# EasyEDA Pro project ProProject_drv8303_f405rgt6_3_5_2025-03-30.epro, board PCB1
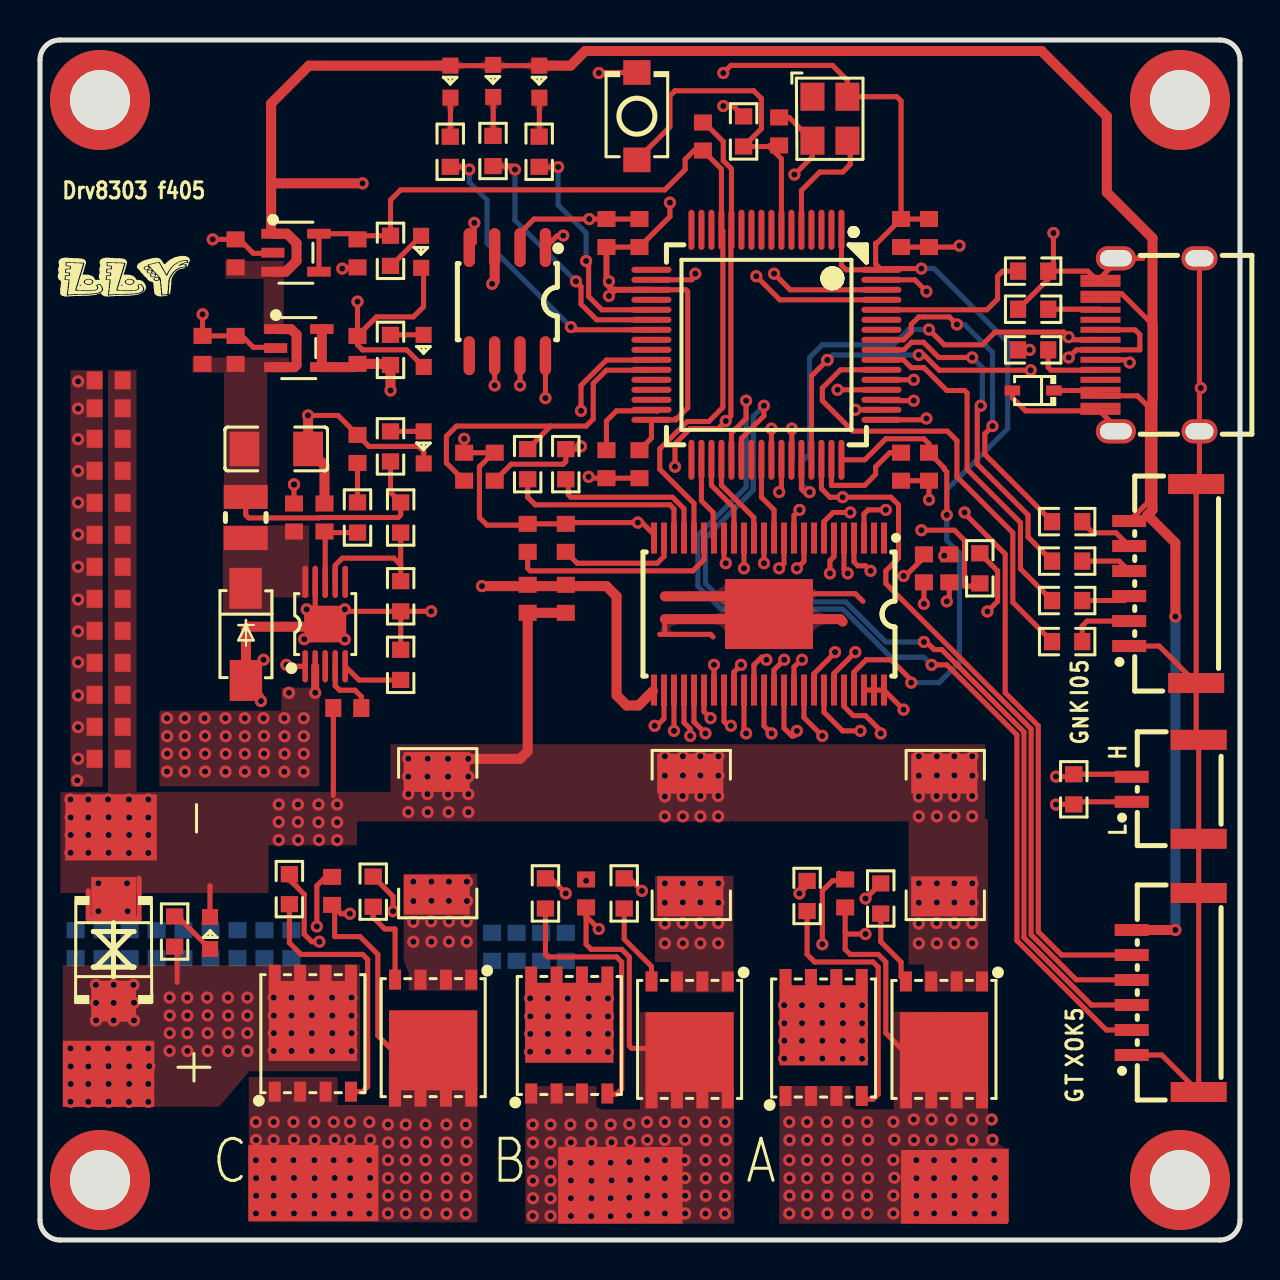
[diagram p1: board, top side]
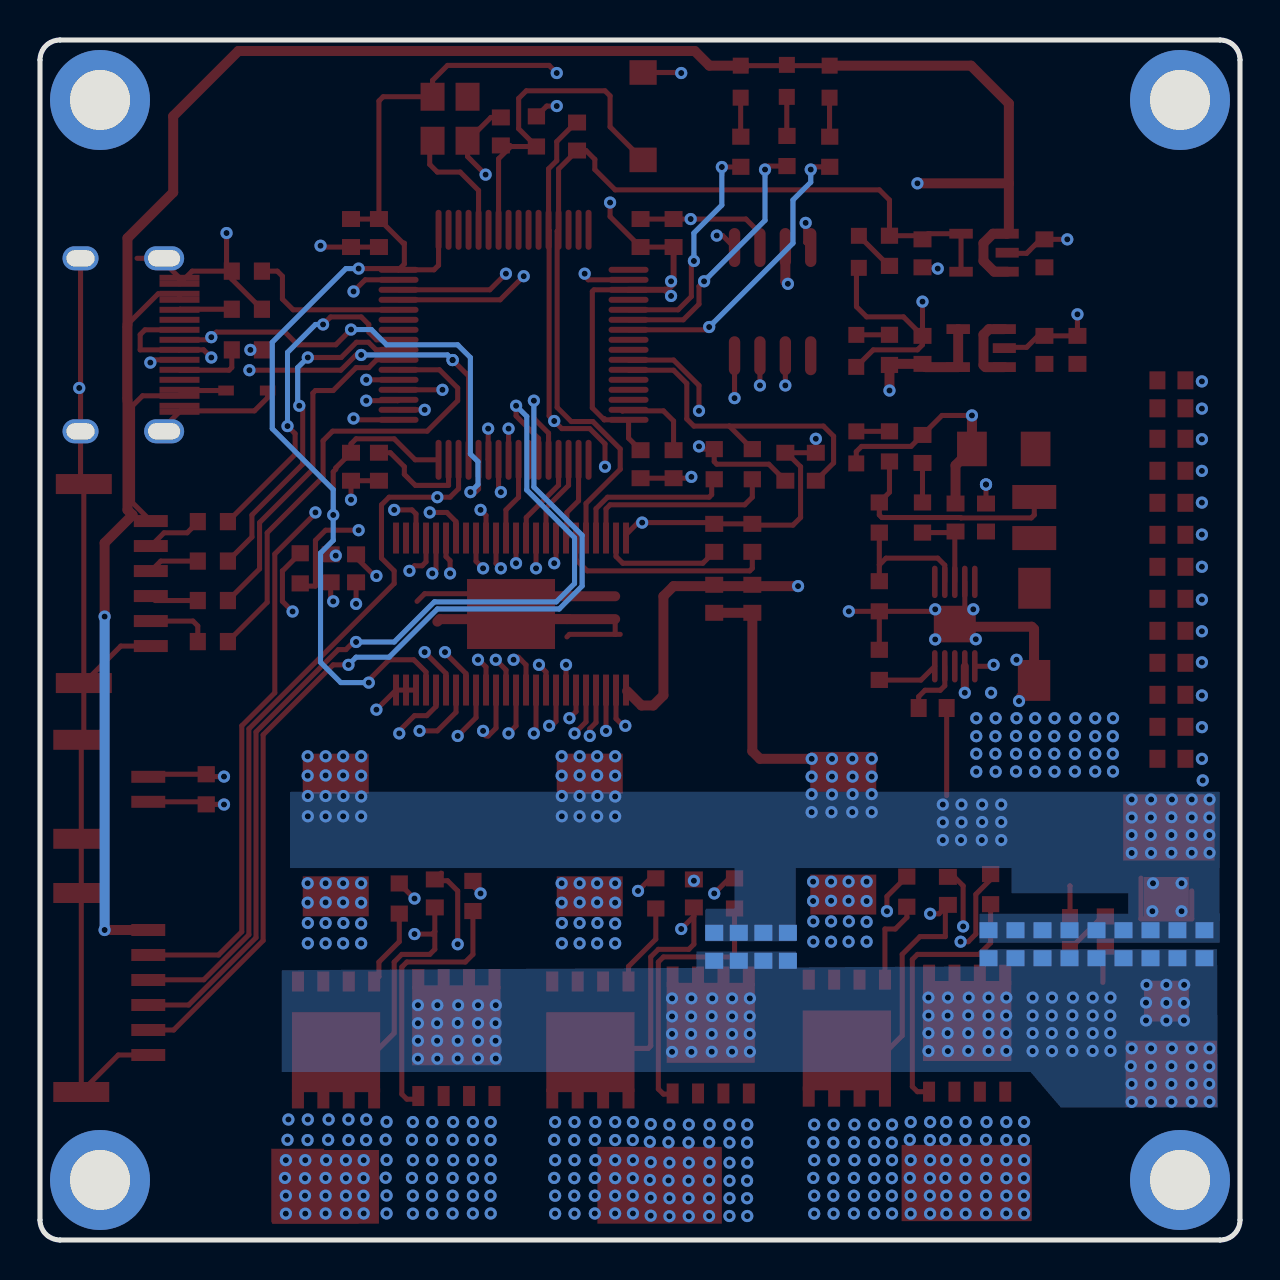
[diagram p2: board, bottom side, seen from below]

Outline 60 x 60 mm; copper layers: Top Layer, Inner1, Inner2, Bottom Layer. Coordinates in mm from the lower left corner of the outline.
Outline path: 0,59 0,1 arc(0.29,0.29) 1,0 59,0 arc(59.71,0.29) 60,1 60,59 arc(59.71,59.71) 59,60 1,60 arc(0.29,59.71) 0,59
Stack: Top Layer 0.035mm 外层铜厚1oz / Dielectric1 0.2104mm 7628 RC49% 8.6mil / Inner1 0.0152mm 内层铜厚 / Dielectric2 1.065mm 1.1mm H/HOZ 含铜 / Inner2 0.0152mm 内层铜厚 / Dielectric3 0.2104mm 7628 RC49% 8.6mil / Bottom Layer 0.035mm 外层铜厚1oz

## Design rules (mm)
template: JLCPCB Capability(Two Layers Board)
spacing copperThickness1oz (default): track to track 0.102, other pairs 0.152 to 0.3
spacing copperThickness2oz: track to track 0.203, other pairs 0.152 to 0.3
track width copperThickness1oz (default): min 0.127, default 0.254, max 2.54
track width copperThickness2oz: min 0.203, default 0.254, max 2.54
differential pair differentialPair (default): width min 0.127, default 0.254, max 2.54; gap min 0.152, default 0.152
via viaSize (default): diameter min 0.5, default 0.61, max 10; hole min 0.3, default 0.305, max 6.3

## Placement (name value [footprint] x y rotation side)
C1  2.2uf  [C0603]  28.32 38.79 90 top
C2  2.2uf  [C0603]  43.05 38.66 90 top
C3  0.1uf  [C0603]  36.96 55.43 270 top
C4  22nF  [C0603]  44.2 33.58 90 top
C7  0.1uf  [C0603]  26.29 32.06 90 top
C8  2.2uf  [C0603]  24.38 32.06 90 top
C9  1uf  [C0603]  26.29 35.11 90 top
C10  2.2uf  [C0603]  45.47 33.58 90 top
C11  1uf  [C0603]  24.38 35.11 90 top
C12  100nF  [C0603]  40.26 17.33 270 top
C13  100nF  [C0603]  27.31 17.33 270 top
C14  100nF  [C0603]  14.6 17.45 270 top
C15  2.2nf  [C0603]  22.73 38.66 270 top
C16  2.2nf  [C0603]  21.21 38.66 270 top
C17  100nF  [C0603]  12.7 36.12 90 top
C18  2.2uf  [C0603]  3.43 42.98 0 top
C19  6.8nF  [C0603]  15.37 26.6 0 top
C20  6.8pf  [C0603]  14.22 36.12 90 top
C21  4.7nf  [C0603]  15.88 39.55 90 top
C27  0.1uF  [C0603]  9.78 44.51 270 top
C28  0.1uF  [C0603]  15.88 44.51 270 top
C32  0.1uF  [C0603]  9.78 49.33 270 top
C33  0.1uF  [C0603]  15.88 49.33 90 top
C85  100nF  [C0603]  44.45 38.66 90 top
C86  100nF  [C0603]  29.97 38.79 90 top
C87  100nF  [C0603]  43.05 50.35 90 top
C88  100nF  [C0603]  44.45 50.35 90 top
C89  100nF  [C0603]  28.32 50.35 270 top
C90  100nF  [C0603]  29.97 50.35 270 top
C91  100nF  [C0603]  33.15 55.17 270 top
C97  47uf  [C0603]  3.43 41.58 180 top
C98  47uf  [C0603]  3.43 40.06 180 top
C99  47uf  [C0603]  3.43 38.46 180 top
C100  47uf  [C0603]  3.43 36.86 180 top
C101  47uf  [C0603]  3.43 35.26 180 top
C102  47uf  [C0603]  3.43 33.66 180 top
C103  47uf  [C0603]  3.43 32.06 180 top
C104  47uf  [C0603]  3.43 30.46 180 top
C105  47uf  [C0603]  3.43 28.86 180 top
C106  47uf  [C0603]  3.43 27.26 180 top
C107  47uf  [C0603]  3.43 25.66 180 top
C108  47uf  [C0603]  3.43 24.06 180 top
C109  47uF  [C1206]  11.81 39.55 0 top
C110  0.1uF  [C0603]  8.13 44.51 90 top
C111  47uf  [C0603]  12.57 14.79 270 bottom
C112  47uf  [C0603]  7.18 14.79 270 bottom
C113  47uf  [C0603]  11.22 14.79 270 bottom
C114  47uf  [C0603]  9.87 14.79 270 bottom
C115  47uf  [C0603]  8.53 14.79 270 bottom
C116  47uf  [C0603]  5.83 14.79 270 bottom
C117  47uf  [C0603]  4.48 14.79 270 bottom
C118  47uf  [C0603]  3.13 14.79 270 bottom
C120  47uf  [C0603]  26.29 14.66 270 bottom
C121  47uf  [C0603]  25.06 14.66 270 bottom
C122  47uf  [C0603]  23.83 14.66 270 bottom
C123  47uf  [C0603]  22.61 14.66 270 bottom
C124  47uf  [C0603]  1.78 14.79 270 bottom
CN2  WAFER-GH1.25-2PLB  [CONN-TH_2P-P1.25_XUNPU_WAFER-GH1.25-2PLB]  56.26 22.53 90 top
D4  B16WS  [SOD-323_L1.7-W1.3-LS2.5-FD]  49.66 42.47 0 top
D5  SS34  [SMA_L4.3-W2.6-LS5.0-FD]  10.29 30.28 90 top
D6  SMBJ36CA  [SMB_L4.6-W3.6-LS5.4-BI]  3.68 14.53 270 top
L3  22uH  [IND-SMD_L2.5-W2.0]  10.29 36.12 270 top
LED4  -  [LED_0603]  24.96 57.97 90 top
LED5  -  [LED_0603]  22.65 58.01 90 top
LED6  -  [LED_0603]  19.18 39.68 90 top
LED7  -  [LED_0603]  19.18 44.51 90 top
LED9  -  [LED_0603]  19.05 49.46 90 top
LED10  -  [LED_0603]  20.51 57.97 90 top
LED11  -  [LED_0603]  8.51 15.3 270 top
N  WAFER-GH1.25-6PLB  [CONN-SMD_6P-P1.25_XUNPU_WAFER-GH1.25-6PLB]  56.13 32.82 90 top
NOREF  -  [Pad_e122]  3 3 0 top
NOREF#2  -  [Pad_e16011]  46.23 2.66 0 top
NOREF#3  -  [Pad_e86]  3.56 20.63 0 top
NOREF#4  -  [Pad_e16010]  29.02 2.74 0 top
NOREF#5  -  [Pad_e124]  57 3 0 top
NOREF#6  -  [Pad_e16012]  45.72 2.66 0 top
NOREF#7  -  [Pad_e126]  57 57 0 top
NOREF#8  -  [Pad_e16009]  13.67 2.85 0 top
NOREF#9  -  [Pad_e287]  11.84 2.81 0 top
NOREF#10  -  [Pad_e125]  3 57 0 top
NOREF#11  -  [Pad_e93]  47.12 2.72 180 top
NOREF#12  -  [Pad_e85]  3.43 8.31 0 top
NOREF#13  -  [Pad_e94]  29.46 2.72 0 top
Q1  HYG025N06LS1C2  [DFN-8_L5.9-W5.2-P1.27-LS6.2-BL]  39.18 10.12 0 top
Q5  HYG025N06LS1C2  [DFN-8_L5.9-W5.2-P1.27-LS6.2-BL]  26.46 10.25 0 top
Q6  HYG025N06LS1C2  [DFN-8_L5.9-W5.2-P1.27-LS6.2-BL]  13.64 10.34 0 top
Q7  HYG025N06LS1C2  [DFN-8_L5.9-W5.2-P1.27-LS6.2-BL]  45.2 10 180 top
Q8  HYG025N06LS1C2  [DFN-8_L5.9-W5.2-P1.27-LS6.2-BL]  32.48 10 180 top
Q9  HYG025N06LS1C2  [DFN-8_L5.9-W5.2-P1.27-LS6.2-BL]  19.66 10.09 180 top
R1  4.7k  [R0603]  49.66 48.44 0 top
R2  10K  [R0603]  35.18 55.43 270 top
R3  18K  [R0603]  46.99 33.58 270 top
R4  22R  [R0603]  26.29 38.79 270 top
R5  22R  [R0603]  24.38 38.79 270 top
R16  5.1K  [R0603]  49.66 44.51 0 top
R17  5.1K  [R0603]  49.66 46.54 180 top
R23  120R  [R0603]  51.69 22.53 90 top
R26  1K  [R0603]  24.96 54.41 90 top
R27  1K  [R0603]  22.65 54.45 90 top
R28  1K  [R0603]  17.53 39.68 270 top
R29  1K  [R0603]  17.53 44.51 270 top
R31  1K  [R0603]  17.53 49.46 90 top
R36  1K  [R0603]  20.51 54.41 90 top
R55  86.6k  [R0603]  15.88 36.12 90 top
R56  52.3k  [R0603]  18.03 36.12 270 top
R57  10k  [R0603]  18.03 32.19 270 top
R64  365K  [R0603]  18.03 28.76 270 top
R65  2.2R  [R0603]  38.35 17.2 90 top
R66  2.2R  [R0603]  25.27 17.33 90 top
R67  2.2R  [R0603]  12.47 17.54 90 top
R68  2.2R  [R0603]  16.66 17.42 90 top
R69  2.2R  [R0603]  29.21 17.33 90 top
R70  2.2R  [R0603]  42.04 17.07 90 top
R71  22R  [R0603]  51.36 35.92 180 top
R72  22R  [R0603]  51.36 33.95 180 top
R73  22R  [R0603]  51.36 31.97 180 top
R74  22R  [R0603]  51.36 29.92 180 top
R75  10K  [R0603]  6.73 15.42 270 top
SW9  TS-1088-AR02016  [SW-SMD_L3.9-W3.0-P4.45]  29.84 56.19 90 top
U1  STM32F405RGT6TR  [LQFP-64_L10.0-W10.0-P0.50-LS12.0-BL]  36.32 44.76 180 top
U2  DRV8303DCA  [HTSSOP-48_L12.5-W6.1-P0.50-LS8.1-BL-EP4.4]  36.45 31.3 180 top
U3  TPS54160ADGQR  [MSOP-10_L3.0-W3.0-P0.50-LS5.0-BL-EP]  14.26 30.8 0 top
U6  RT9013-33GB  [SOT-23-5_L3.0-W1.7-P0.95-LS2.8-BL]  12.94 44.59 270 top
U7  RT9013-33GB  [SOT-23-5_L3.0-W1.7-P0.95-LS2.8-BL]  12.79 49.36 270 top
U8  0.5mΩ  [RES-SMD_L6.4-W3.2-R2512]  32.51 20.25 270 top
U9  0.5mΩ  [RES-SMD_L6.4-W3.2-R2512]  19.84 20.34 270 top
U12  WAFER-GH1.25-6PLB  [CONN-SMD_6P-P1.25_XUNPU_WAFER-GH1.25-6PLB]  56.26 12.38 90 top
U14  0.5mΩ  [RES-SMD_L6.4-W3.2-R2512]  45.21 20.25 270 top
U15  TJA1050T/CM,118  [SOIC-8_L5.0-W4.0-P1.27-LS6.0-BL]  23.37 46.92 180 top
USBC1  TYPE-C-31-M-12  [USB-C_SMD-TYPE-C-31-M-12]  55.5 44.76 90 top
X2  8MHz  [OSC-SMD_4P-L3.2-W2.5-BL]  39.5 56.06 270 top

## Footprints (pads in the part's own frame, mm; a bottom-side part is the same pattern mirrored in y, then rotated)
C0603
  rect 0.8x0.9 smd: 1(-0.7,0) 2(0.7,0)
C1206
  rect 1.485x1.728 smd: 1(-1.593,0) 2(1.593,0)
CONN-SMD_6P-P1.25_XUNPU_WAFER-GH1.25-6PLB
  rect 0.6x1.7 smd: 1(-3.125,1.675) 2(-1.875,1.675) 3(-0.625,1.675) 4(0.625,1.675) 5(1.875,1.675) 6(3.125,1.675)
  rect 1x2.8 smd: 7(4.975,-1.675) 8(-4.975,-1.675)
CONN-TH_2P-P1.25_XUNPU_WAFER-GH1.25-2PLB
  rect 0.6x1.7 smd: 1(-0.625,1.675) 2(0.625,1.675)
  rect 1x2.8 smd: 3(2.475,-1.675) 4(-2.475,-1.675)
DFN-8_L5.9-W5.2-P1.27-LS6.2-BL
  rect 0.6x1 smd: 1(-1.905,-2.925) 2(-0.635,-2.925) 3(0.635,-2.925) 4(1.905,-2.925) 5(1.905,2.925) 6(0.635,2.925) 7(-0.635,2.925) 8(-1.905,2.925)
  rect 4.41x4 smd: 9(0,0.61)
HTSSOP-48_L12.5-W6.1-P0.50-LS8.1-BL-EP4.4
  rect 0.3x1.55 smd: 1(-5.75,-3.8) 2(-5.25,-3.8) 3(-4.75,-3.8) 4(-4.25,-3.8) 5(-3.75,-3.8) 6(-3.25,-3.8) 7(-2.75,-3.8) 8(-2.25,-3.8) 9(-1.75,-3.8) 10(-1.25,-3.8) 11(-0.75,-3.8) 12(-0.25,-3.8) 13(0.25,-3.8) 14(0.75,-3.8) 15(1.25,-3.8) 16(1.75,-3.8) 17(2.25,-3.8) 18(2.75,-3.8) 19(3.25,-3.8) 20(3.75,-3.8) 21(4.25,-3.8) 22(4.75,-3.8) 23(5.25,-3.8) 24(5.75,-3.8) 25(5.75,3.8) 26(5.25,3.8) 27(4.75,3.8) 28(4.25,3.8) 29(3.75,3.8) 30(3.25,3.8) 31(2.75,3.8) 32(2.25,3.8) 33(1.75,3.8) 34(1.25,3.8) 35(0.75,3.8) 36(0.25,3.8) 37(-0.25,3.8) 38(-0.75,3.8) 39(-1.25,3.8) 40(-1.75,3.8) 41(-2.25,3.8) 42(-2.75,3.8) 43(-3.25,3.8) 44(-3.75,3.8) 45(-4.25,3.8) 46(-4.75,3.8) 47(-5.25,3.8) 48(-5.75,3.8)
  rect 4.4x3.5 smd: 49(0,0)
IND-SMD_L2.5-W2.0
  rect 1.2x2.2 smd: 1(1.028,0) 2(-1.028,0)
LED_0603
  rect 0.8x0.8 smd: 1(-0.851,-0.01) 2(0.75,-0.005)
LQFP-64_L10.0-W10.0-P0.50-LS12.0-BL
  oval 0.3x2 smd: 1(-3.75,-5.75) 2(-3.25,-5.75) 3(-2.75,-5.75) 4(-2.25,-5.75) 5(-1.75,-5.75) 6(-1.25,-5.75) 7(-0.75,-5.75) 8(-0.25,-5.75) 9(0.25,-5.75) 10(0.75,-5.75) 11(1.25,-5.75) 12(1.75,-5.75) 13(2.25,-5.75) 14(2.75,-5.75) 15(3.25,-5.75) 16(3.75,-5.75) 33(3.75,5.75) 34(3.25,5.75) 35(2.75,5.75) 36(2.25,5.75) 37(1.75,5.75) 38(1.25,5.75) 39(0.75,5.75) 40(0.25,5.75) 41(-0.25,5.75) 42(-0.75,5.75) 43(-1.25,5.75) 44(-1.75,5.75) 45(-2.25,5.75) 46(-2.75,5.75) 47(-3.25,5.75) 48(-3.75,5.75)
  oval 2x0.3 smd: 17(5.75,-3.75) 18(5.75,-3.25) 19(5.75,-2.75) 20(5.75,-2.25) 21(5.75,-1.75) 22(5.75,-1.25) 23(5.75,-0.75) 24(5.75,-0.25) 25(5.75,0.25) 26(5.75,0.75) 27(5.75,1.25) 28(5.75,1.75) 29(5.75,2.25) 30(5.75,2.75) 31(5.75,3.25) 32(5.75,3.75) 49(-5.75,3.75) 50(-5.75,3.25) 51(-5.75,2.75) 52(-5.75,2.25) 53(-5.75,1.75) 54(-5.75,1.25) 55(-5.75,0.75) 56(-5.75,0.25) 57(-5.75,-0.25) 58(-5.75,-0.75) 59(-5.75,-1.25) 60(-5.75,-1.75) 61(-5.75,-2.25) 62(-5.75,-2.75) 63(-5.75,-3.25) 64(-5.75,-3.75)
MSOP-10_L3.0-W3.0-P0.50-LS5.0-BL-EP
  oval 0.28x1.62 smd: 1(-1,-2.11) 2(-0.5,-2.11) 3(0,-2.11) 4(0.5,-2.11) 5(1,-2.11) 6(1,2.11) 7(0.5,2.11) 8(0,2.11) 9(-0.5,2.11) 10(-1,2.11)
  rect 2.1x1.83 smd: 11(0,0)
OSC-SMD_4P-L3.2-W2.5-BL
  rect 1.4x1.2 smd: 1(-1.1,-0.875) 2(1.1,-0.875) 3(1.1,0.875) 4(-1.1,0.875)
Pad_e85
  custom 4.572x3.306 smd: 65(0,0)
Pad_e86
  custom 4.572x3.306 smd: 65(0,0)
Pad_e93
  custom 2.667x3.683 smd: 66(0,0)
Pad_e94
  custom 2.667x3.683 smd: 66(0,0)
Pad_e122
  round 5 hole 3: 1(0,0)
Pad_e124
  round 5 hole 3: 1(0,0)
Pad_e125
  round 5 hole 3: 1(0,0)
Pad_e126
  round 5 hole 3: 1(0,0)
Pad_e287
  custom 2.667x3.683 smd: 66(0,0)
Pad_e16009
  custom 6.508x3.81 smd: 1(0,0)
Pad_e16010
  custom 6.223x3.838 smd: 2(0,0)
Pad_e16011
  custom 4.318x3.683 smd: 3(0,0)
Pad_e16012
  custom 5.34x3.683 smd: 4(0,0)
R0603
  rect 0.806x0.864 smd: 1(-0.753,0) 2(0.753,0)
RES-SMD_L6.4-W3.2-R2512
  rect 2x3.3 smd: 1(-3.067,0) 2(3.067,0)
SMA_L4.3-W2.6-LS5.0-FD
  rect 2.046x1.62 smd: 1(-2.304,-0.009) 2(2.304,0.009)
SMB_L4.6-W3.6-LS5.4-BI
  rect 2.047x2.241 smd: 1(-2.591,0) 2(2.591,0)
SOD-323_L1.7-W1.3-LS2.5-FD
  rect 0.78x0.5 smd: 1(-1.04,0) 2(1.04,0)
SOIC-8_L5.0-W4.0-P1.27-LS6.0-BL
  oval 0.569x1.95 smd: 1(-1.905,-2.705) 2(-0.635,-2.705) 3(0.635,-2.705) 4(1.905,-2.705) 5(1.905,2.705) 6(0.635,2.705) 7(-0.635,2.705) 8(-1.905,2.705)
SOT-23-5_L3.0-W1.7-P0.95-LS2.8-BL
  rect 0.49x1.157 smd: 1(-0.95,-1.153) 2(0,-1.153) 3(0.95,-1.153)
  rect 0.49x1.175 smd: 4(0.95,1.153) 5(-0.95,1.153)
SW-SMD_L3.9-W3.0-P4.45
  rect 1.23x1.36 smd: 1(-2.185,0) 2(2.185,0)
USB-C_SMD-TYPE-C-31-M-12
  oval 1.2x2 hole 0.8x1.6: 0(-4.325,1.706) 1(4.325,1.706)
  oval 1.2x1.8 hole 0.8x1.4: 2(4.325,-2.474) 3(-4.325,-2.474)
  rect 0.3x2 smd: A1(-3.35,2.474) A4(-2.55,2.474) A5(-1.25,2.474) A6(-0.25,2.474) A7(0.25,2.474) A8(1.25,2.474) A9(2.55,2.474) A12(3.35,2.474) B1(3.05,2.474) B4(2.25,2.474) B5(1.75,2.474) B6(0.75,2.474) B7(-0.75,2.474) B8(-1.75,2.474) B9(-2.25,2.474) B12(-3.05,2.474)

## Nets
As in the schematic, except:
5V: C27.2 C32.2 C109.1 C110.1 D4.2 L3.2 LED4.2 LED5.2 LED10.2 N.6 R28.2 R56.1 U6.1 U6.3 U7.1 U7.3 U12.6 U15.3 USBC1.A4 USBC1.A9 USBC1.B4 USBC1.B9
GND: C1.1 C2.1 C3.1 C10.2 C20.2 C21.2 C27.1 C28.1 C85.1 C86.1 C87.1 C88.1 C89.1 C90.1 C109.2 C110.2 CN2.3 CN2.4 D4.1 D5.1 LED6.1 LED7.1 LED9.1 N.1 N.7 N.8 R1.2 R3.1 R16.1 R17.2 R57.2 R64.1 SW9.2 U1.18 U1.63 U2.46 U2.47 U2.48 U2.49 U3.9 U3.11 U6.2 U12.1 U12.7 U12.8 U15.2 U15.8 USBC1.0 USBC1.1 USBC1.2 USBC1.3 USBC1.A1 USBC1.A12 USBC1.B1 USBC1.B12 X2.2
PGND: C7.1 C8.1 C18.2 C19.1 C97.1 C98.1 C99.1 C100.1 C101.1 C102.1 C103.1 C104.1 C105.1 C106.1 C107.1 C108.1 C111.1 C112.1 C113.1 C114.1 C115.1 C116.1 C117.1 C118.1 C120.1 C121.1 C122.1 C123.1 C124.1 D6.1 LED11.1 NOREF#3.65 Q7.1 Q7.2 Q7.3 U2.26 U2.28 U2.40 U8.1 U9.1 U14.1 U14.2
DCBUS: C7.2 C8.2 C18.1 C97.2 C98.2 C99.2 C100.2 C101.2 C102.2 C103.2 C104.2 C105.2 C106.2 C107.2 C108.2 C111.2 C112.2 C113.2 C114.2 C115.2 C116.2 C117.2 C118.2 C120.2 C121.2 C122.2 C123.2 C124.2 D6.2 NOREF#12.65 Q1.5 Q1.6 Q1.7 Q1.8 Q1.9 Q5.5 Q5.6 Q5.7 Q5.8 Q5.9 Q6.5 Q6.6 Q6.7 Q6.8 Q6.9 R75.2 U2.25 U3.2
SH_A: C12.2 NOREF#2.3 NOREF#6.4 NOREF#11.66 Q1.1 Q1.2 Q1.3 Q7.5 Q7.6 Q7.7 Q7.8 Q7.9 U2.42
SH_B: C13.2 NOREF#4.2 NOREF#13.66 Q5.1 Q5.2 Q5.3 Q8.5 Q8.6 Q8.7 Q8.8 Q8.9 U2.37
SH_C: C14.2 NOREF#8.1 NOREF#9.66 Q6.1 Q6.2 Q6.3 Q9.5 Q9.6 Q9.7 Q9.8 Q9.9 U2.32
$1N19444: N.5 R71.1
$1N19497: N.4 R72.1
$1N19526: N.3 R73.1
$1N19555: N.2 R74.1

Pads without a net: NOREF 1; NOREF#5 1; NOREF#7 1; NOREF#10 1; U1 2 3 4 6 8 9 10 11 14 15 16 17 20 24 25 28 29 30 33 39 58 59; U2 1 2 8; U3 3 6; U15 5; USBC1 A8 B8; X2 1

## Via types
v1: diameter 0.61, hole 0.305, Top Layer to Bottom Layer, 630 vias

## Routing (per net, layer and track width the routed paths; a pad name or vN(x,y) marks a point on that pad's centre or on a via; arc(x,y) is an arc through that point)
5V: length 152.5
  Top Layer w0.254: 20.2,58.72 24.77,58.72 ; L3.2 10.29,36.25 10.44,36.1 13.95,36.1 13.97,36.12 17.91,36.12 18.03,36.25 R56.1 17.53,37.39 R28.2 ; USBC1.B9 52.99,42.47 D4.2 ; 55.37,41.71 54.87,42.21 USBC1.A4 ; 55.37,41.71 55.75,42.09 55.75,45.65 54.09,47.31 USBC1.A9 USBC1.B4 ; 55.37,41.71 55.37,36.86 54.46,35.95
  Top Layer w0.5: 11.56,52.83 11.56,56.83 13.45,58.72 20.2,58.72 ; 11.56,52.83 v1(16.13,52.83) ; 11.56,52.83 11.56,50.4 U7.1 12.35,50.31 12.83,49.84 12.83,48.95 12.29,48.41 U7.3 ; U15.3 22.73,47.94 v1(22.61,47.81) ; U6.1 12.55,45.55 12.83,45.27 12.83,43.74 12.73,43.64 U6.3 ; 24.77,58.72 26.53,58.72 27.26,59.45 50.08,59.45 53.34,56.19 53.34,52.38 55.63,50.09 55.63,36.5 55.37,36.25 56.77,34.85 v1(56.77,31.17) ; U12.6 v1(56.77,15.5)
  Inner1 w0.5: v1(16.13,52.83) 18.72,52.83 20.7,50.86 20.7,48.06 20.96,47.81 v1(22.61,47.81) 25.27,47.81
  Bottom Layer w0.5: v1(56.77,31.17) 56.77,15.55
AGND: length 65.3
  Top Layer w0.254: 22.67,39.36 21.97,38.66 21.97,36.12 22.35,35.74 24.32,35.74 C11.2 C9.2 26.35,35.87 30.1,35.87 30.7,35.27 U2.24 ; 22.67,39.36 C15.1 ; 22.67,39.36 C16.1 v1(21.21,40.06) ; U7.2 11.61,49.33 10.67,49.33 9.97,50.03 C32.1 v1(8.64,50.03) ; v1(31.75,38.66) 31.75,39.81 32.51,40.57 33.91,40.57 v1(34.29,40.95) 34.54,41.2 34.54,50.48 U1.12 34.57,53.56 34.16,53.97 34.16,54.92 33.31,55.77 33.15,55.77 ; C33.1 15.18,48.63 v1(15.11,48.57)
  Inner1 w0.254: v1(21.21,40.06) 21.21,41.33 21.08,41.46 16,41.46 15.11,42.35 v1(15.11,48.57) 15.11,49.2 14.86,49.46 11.81,49.46 11.68,49.33 10.67,49.33 10.67,49.46 10.03,50.09 9.97,50.03 v1(8.64,50.03) ; v1(31.75,38.66) 29.97,38.66 29.84,38.54 29.84,35.87
  vias: v1(29.89,35.87)
AVCC: length 46.8
  Top Layer w0.254: U2.20 32.7,36.83 30.99,38.54 30.99,39.55 32.36,40.92 33.44,40.92 34.14,41.63 34.14,50.44 U1.13 34.07,53.55 C91.2 32.7,54.47 32.26,54.03 32.26,53.52 31.24,52.51 18.03,52.51 17.53,52 R31.2 16.06,50.21 C33.2 15.59,50.31 U7.5 U7.4
GND: length 174.6
  Top Layer w0.254: 43.18,26.47 v1(43.18,26.52) U2.48 U2.47 U2.46 ; v1(44.32,47.43) 43.74,48.01 U1.63 ; 54.46,29.7 55.96,29.7 N.8 ; v1(45.97,49.71) 45.91,49.65 C88.1 C87.1 ; 19.19,38.83 19.19,39.42 18.92,39.68 16.45,39.68 C21.2 14.9,41.23 v1(13.4,41.23) ; U3.9 13.76,31.3 U3.11 14.9,31.43 R57.2 ; USBC1.0 53.79,40.64 USBC1.A1 52.98,41.46 49.28,41.46 48.62,42.12 48.62,42.47 ; N.8 N.7 57.97,37.96 USBC1.3 57.97,42.53 v1(58.04,42.6) 57.97,42.67 57.97,49.08 ; N.8 57.81,25.14 CN2.3 CN2.4 U12.7 U12.8 56.09,9.25 U12.1 ; C86.1 C1.1 27.56,38.09 ; v1(11.05,26.95) 11.05,27.23 D5.1 10.3,28.26 10.42,28.26 v1(11.18,29.01) ; U6.2 11.75,44.63 10.67,44.63 10.09,45.21 C27.1 C110.2 v1(8.13,46.28) ; U15.2 24,50.35 24.7,51.05 v1(27.47,51.05) C89.1 C90.1 ; C2.1 C85.1 v1(44.45,37.01) ; C28.1 v1(15.88,46.92) ; C28.1 15.88,44.76 16.13,44.51 18.34,44.51 19.19,43.66 ; C28.1 16.83,46.16 18.67,46.16 19.18,46.67 19.18,48.49 LED9.1 ; v1(47.37,31.42) 47.88,31.93 47.88,33.46 47.87,33.46 R3.1 ; R1.2 50.41,48.04 R17.2 ; R1.2 52.39,48.44 USBC1.B1 USBC1.A12 53.79,48.88 53.79,49.08 55.15,49.08 ; R1.2 50.67,48.71 v1(50.67,50.35) ; R57.2 R64.1 ; R57.2 v1(19.56,31.43) ; C3.1 37.46,56.13 X2.2 38.62,54.17 v1(37.72,53.27) ; SW9.2 27.97,58.38 v1(27.94,58.35) ; 41.15,31.93 40.77,32.31 37.47,32.31 U2.49 36.32,31.17 33.53,31.17 33.66,31.04 ; 31.24,30.28 33.53,30.28 33.66,30.16 ; 31.24,30.28 30.99,30.28 ; 31.24,30.28 31.24,31.04 ; U1.18 32.59,48.01 32.77,48.19 ; U15.8 v1(25.27,42.09)
  Top Layer w0.5: 31.24,32.19 35.25,32.19 36.4,31.04 ; C20.2 14.22,38.73 C109.2 v1(13.4,41.23) ; 36.4,31.04 40,31.04 40.13,30.92 ; 36.4,31.04 31.24,31.04 ; U3.11 14.13,30.66 10.41,30.66 10.3,30.55 10.3,28.26
  vias: v1(13.21,30.04) v1(13.34,31.53) v1(15.24,31.53) v1(15.24,30.03) v1(27.43,38.16) v1(32.77,48.32) v1(45.21,34.22) v1(49.48,44.51)
PGND: length 77.5
  Top Layer w0.254: C19.1 14.67,22.22 ; 2.41,17.45 2.41,16.06 4.95,16.06 4.95,18.09 ; 8.51,17.71 8.5,17.7 LED11.1 ; U2.28 32.2,25.87 32.51,25.56 v1(32.51,25.2) ; U2.40 38.2,26.12 v1(39.12,25.2) ; v1(30.73,25.71) 30.84,25.71 31.2,26.07 U2.26
  Top Layer w0.5: v1(21.42,24.06) 24,24.06 24.38,24.44 C8.1 C7.1
  Inner1 w0.254: v1(19.39,21.39) 19.43,21.35 19.43,19.87 19.69,19.61 21.72,19.61 22.22,20.12 22.22,24.31 23.4,25.48 30.5,25.48 v1(30.73,25.71) ; v1(32.14,21.18) 32.14,20.36 32.92,19.59 33.63,19.59 34.7,20.66 34.7,24.29 34.24,24.74 32.97,24.74 v1(32.51,25.2) ; v1(43.94,14.83) 43.26,14.15 38.23,14.15 37.24,15.14 37.24,23.33 39.11,25.2 v1(39.12,25.2)
  vias: v1(1.52,22.03) v1(1.53,21.13) v1(1.53,20.25) v1(1.52,19.36) v1(2.41,22.03) v1(2.41,21.13) v1(2.41,20.25) v1(2.42,19.36) v1(2.92,17.84) v1(2.92,16.44) v1(3.4,22.03) v1(3.43,21.14) v1(3.43,20.25) v1(3.43,19.36) v1(4.35,17.84) v1(4.44,22.03) v1(4.45,19.35) v1(4.38,16.44) v1(4.46,21.12) v1(4.46,20.25) v1(5.42,22.03) v1(5.42,21.12) v1(5.42,20.25) v1(5.42,19.35) v1(11.94,21.77) v1(11.94,20.9) v1(11.94,20) v1(12.9,21.77) v1(12.9,20.9) v1(12.91,20) v1(13.93,21.77) v1(13.93,20.89) v1(13.95,20) v1(14.86,21.77) v1(14.86,20.88) v1(14.86,20) v1(18.41,24.07) v1(18.41,23.17) v1(18.41,22.29) v1(18.41,21.39) v1(19.38,24.07) v1(19.37,23.17) v1(19.37,22.29) v1(20.4,24.06) v1(20.4,23.17) v1(20.4,22.28) v1(20.43,21.39) v1(21.42,23.17) v1(21.42,22.29) v1(21.42,21.39) v1(31.24,24.19) v1(31.24,23.22) v1(31.24,22.17) v1(31.24,21.18) v1(32.14,24.19) v1(32.14,23.23) v1(32.13,22.2) v1(33.02,24.19) v1(33.02,23.23) v1(33.02,22.2) v1(33.02,21.18) v1(33.92,24.19) v1(33.92,23.22) v1(33.91,22.2) v1(33.91,21.19) v1(43.94,24.19) v1(43.94,23.22) v1(43.94,22.17) v1(43.94,21.18) v1(43.94,17.84) v1(43.94,16.86) v1(43.94,15.83) v1(44.84,24.19) v1(44.84,23.23) v1(44.83,22.2) v1(44.84,21.18) v1(44.84,17.84) v1(44.84,16.88) v1(44.83,15.85) v1(44.84,14.83) v1(45.72,24.19) v1(45.72,23.23) v1(45.72,22.2) v1(45.72,21.18) v1(45.72,17.84) v1(45.72,16.88) v1(45.72,15.85) v1(45.72,14.83) v1(46.62,24.19) v1(46.62,23.22) v1(46.61,22.2) v1(46.61,21.19) v1(46.62,17.84) v1(46.62,16.87) v1(46.61,15.85) v1(46.61,14.84)
VCC: length 119.7
  Top Layer w0.254: R2.1 34.66,56.7 v1(34.16,56.7) ; C87.2 43.05,56.95 42.84,57.16 X2.4 40.37,57.98 39.62,58.73 34.54,58.73 v1(34.16,58.35) ; C87.2 41.84,49.84 41.78,49.84 41.78,48.8 U1.64 ; C87.2 C88.2 ; U2.45 40.7,28.4 41.31,29.01 42.54,29.01 43.56,28 v1(43.56,27.87) ; U1.1 40.07,48.74 40.3,48.51 U1.64 ; 31.79,41.01 U1.32 30.57,40.09 C86.2 ; 31.79,41.01 32.38,41.61 32.38,47.43 32.3,47.51 U1.19 ; 31.79,41.01 31.79,41.08 ; v1(31.5,51.87) 31.5,51.17 C90.2 C89.2 ; U1.64 42.13,48.57 v1(44.07,48.57) ; U1.48 41.24,39.01 42.29,40.06 44.2,40.06 44.45,39.81 C85.2 45.21,38.6 45.21,38.54 45.34,38.41 v1(45.34,36.25)
  Top Layer w0.3: C89.2 28.32,47.81 28.62,47.51 28.76,47.51 ; U1.19 28.76,47.51 ; 28.76,47.51 v1(28.45,47.2)
  Top Layer w0.5: U6.5 U6.4 15.71,43.64 C28.2 17.47,43.81 R29.2 v1(17.53,42.47)
  Inner1 w0.254: v1(34.16,58.35) v1(34.16,56.7) 31.88,56.7 31.5,56.32 v1(31.5,51.87)
  Inner1 w0.5: v1(28.45,47.94) v1(28.45,47.2) 28.45,46.67 28.32,46.54 18.29,46.54 17.53,45.78 v1(17.53,42.47)
  Bottom Layer w0.254: v1(44.07,48.57) 44.7,48.57 48.39,44.89 48.39,40.57 45.34,37.52 v1(45.34,36.25) 45.34,34.98 45.97,34.35 45.97,28.89 44.96,27.87 v1(43.56,27.87)
CAN1__H: length 47.4
  Top Layer w0.254: CN2.2 54.46,23.29 R23.2 51.57,23.17 v1(50.8,23.17) ; v1(24,42.73) U15.7
  Inner1 w0.254: v1(24,42.73) 24,34.22 27.15,31.07 46.33,31.07 50.04,27.36 50.04,23.68 50.55,23.17 v1(50.8,23.17)
CAN1__L: length 49.1
  Top Layer w0.254: v1(22.73,42.73) U15.6 ; CN2.1 51.82,21.91 R23.1 50.81,21.78 v1(50.8,21.77)
  Inner1 w0.254: v1(50.8,21.77) 49.66,22.92 49.66,27.23 46.18,30.71 27,30.71 22.73,34.99 v1(22.73,42.73)
CAN1_RX_PB8: length 23.6
  Top Layer w0.254: U1.61 36.99,47.01 v1(35.81,48.19) ; v1(21.72,50.86) 21.72,49.88 U15.4
  Inner1 w0.254: v1(21.72,50.86) 22.22,50.35 22.22,49.89 22.48,49.64 34.37,49.64 v1(35.81,48.19)
CAN1_TX_PB9: length 18.2
  Top Layer w0.254: v1(26.16,50.22) 25.87,50.22 U15.1 ; v1(36.7,48.32) 37.51,47.51 U1.62
  Inner1 w0.254: v1(26.16,50.22) 34.8,50.22 v1(36.7,48.32)
DCBUS: length 31.8
  Top Layer w0.254: 6.86,12.88 6.86,14.54 R75.2
  Top Layer w0.4: v1(13.76,27.36) U3.2
  Top Layer w0.5: 30.65,27.45 29.93,26.73 29.34,26.73 28.83,27.23 28.83,32.19 28.32,32.69 26.22,32.69 ; 24.32,32.69 C8.2 ; 24.32,32.69 26.22,32.69 ; 24.32,32.69 v1(22.1,32.69) ; 26.22,32.69 C7.2
  Inner2 w0.254: v1(12.45,27.36) v1(13.76,27.36)
  Inner2 w0.5: v1(22.1,32.69) 21.84,32.44 21.84,28.38 20.83,27.36 v1(13.76,27.36)
  vias: v1(1.52,9.58) v1(1.53,8.68) v1(1.53,7.8) v1(1.52,6.91) v1(1.91,42.93) v1(1.91,41.57) v1(1.91,40.04) v1(1.91,38.46) v1(1.91,36.87) v1(1.91,35.27) v1(1.91,33.66) v1(1.91,32.02) v1(1.91,30.44) v1(1.91,28.89) v1(1.91,27.23) v1(1.91,25.64) v1(1.91,24.06) v1(1.86,22.98) v1(2.41,9.58) v1(2.41,8.68) v1(2.41,7.8) v1(2.42,6.91) v1(2.79,12.76) v1(2.8,11.86) v1(2.8,10.98) v1(3.4,9.58) v1(3.43,8.69) v1(3.43,7.8) v1(3.43,6.91) v1(3.68,12.76) v1(3.68,11.86) v1(3.68,10.98) v1(4.44,9.58) v1(4.45,6.91) v1(4.46,8.68) v1(4.46,7.8) v1(4.67,12.76) v1(4.7,11.87) v1(4.7,10.98) v1(5.42,9.58) v1(5.42,7.8) v1(5.42,6.91) v1(5.46,8.69) v1(6.35,26.09) v1(6.35,23.42) v1(6.36,25.19) v1(6.36,24.31) v1(6.48,12.12) v1(6.49,11.22) v1(6.49,10.34) v1(6.48,9.45) v1(7.24,26.09) v1(7.24,25.19) v1(7.24,24.31) v1(7.24,23.42) v1(7.37,12.12) v1(7.37,11.22) v1(7.37,10.34) v1(7.37,9.45) v1(8.23,26.09) v1(8.25,25.2) v1(8.25,24.31) v1(8.26,23.42) v1(8.36,12.12) v1(8.38,11.23) v1(8.38,10.34) v1(8.38,9.45) v1(9.27,26.09) v1(9.28,25.19) v1(9.28,24.31) v1(9.27,23.42) v1(9.4,12.12) v1(9.41,11.22) v1(9.41,10.34) v1(9.4,9.45) v1(10.24,26.09) v1(10.24,25.19) v1(10.24,24.31) v1(10.24,23.42) v1(10.37,12.12) v1(10.37,11.22) v1(10.37,10.34) v1(10.37,9.45) v1(11.18,26.09) v1(11.2,25.2) v1(11.2,24.31) v1(11.2,23.42) v1(11.68,12.12) v1(11.69,11.22) v1(11.69,10.34) v1(11.68,9.45) v1(12.22,26.09) v1(12.23,25.19) v1(12.23,24.31) v1(12.22,23.42) v1(12.57,12.12) v1(12.57,11.22) v1(12.57,10.34) v1(12.58,9.45) v1(13.19,26.09) v1(13.19,25.19) v1(13.19,24.31) v1(13.19,23.42) v1(13.56,12.12) v1(13.59,11.23) v1(13.59,10.34) v1(13.59,9.45) v1(14.6,12.12) v1(14.62,11.22) v1(14.62,10.34) v1(14.61,9.45) v1(15.58,12.12) v1(15.58,11.22) v1(15.58,10.34) v1(15.58,9.45) v1(24.51,12.08) v1(24.52,11.18) v1(24.52,10.3) v1(24.51,9.41) v1(25.4,12.08) v1(25.4,11.18) v1(25.4,10.3) v1(25.4,9.41) v1(26.39,12.08) v1(26.41,11.19) v1(26.41,10.3) v1(26.41,9.41) v1(27.43,12.08) v1(27.44,11.18) v1(27.44,10.31) v1(27.43,9.41) v1(28.4,12.08) v1(28.4,11.18) v1(28.4,10.31) v1(28.4,9.41) v1(37.21,11.74) v1(37.22,10.84) v1(37.22,9.96) v1(37.21,9.07) v1(38.1,11.74) v1(38.1,10.84) v1(38.1,9.96) v1(38.1,9.07) v1(39.09,11.74) v1(39.12,10.85) v1(39.12,9.96) v1(39.12,9.07) v1(40.13,11.74) v1(40.15,10.84) v1(40.15,9.96) v1(40.13,9.06) v1(41.1,11.74) v1(41.1,10.84) v1(41.1,9.96) v1(41.1,9.06)
EN_GATE: length 4.2
  Top Layer w0.254: U2.12 36.7,35.1 36.7,36.5 36.07,37.14 U1.40
GH_A: length 19.1
  Top Layer w0.254: R65.2 38.35,17.71 v1(37.97,17.33) ; U2.43 39.7,28.33 v1(40.77,29.39)
  Inner1 w0.254: 37.85,17.2 37.59,17.45 37.59,22.85 40,25.26 40,26.09 39.17,26.93 39.17,29.77 39.42,30.03 40.13,30.03 v1(40.77,29.39)
GH_B: length 28.5
  Top Layer w0.254: 37.72,25.2 37.59,25.2 37.2,25.59 U2.38 ; v1(26.29,17.33) 25.54,18.08 R66.2
  Inner1 w0.254: v1(37.85,25.46) 37.85,24.95 36.53,23.63 36.53,15.25 34.54,13.26 30.74,13.26 29.22,14.79 26.92,14.79 26.54,15.17 26.54,17.07 v1(26.29,17.33)
GH_C: length 38.3
  Top Layer w0.254: v1(13.97,14.92) 13.59,14.92 13.21,15.3 13.21,17.28 12.47,18.02 R67.2 ; U2.33 34.7,28.4 34.93,28.63 35.05,28.63
  Inner1 w0.254: v1(35.05,28.76) 35.05,28.88 33.93,30 24.11,30 21.04,26.93 18.24,26.93 16.46,25.15 16.46,20.2 14.86,18.6 14.86,15.3 14.48,14.92 v1(13.97,14.92)
GL_A: length 18
  Top Layer w0.254: v1(41.28,17.07) 41.28,17.07 R70.2 ; v1(39.75,29.39) 39.75,29.37 38.7,28.32 U2.41
  Inner1 w0.254: v1(41.28,17.07) 41.28,19.04 40.98,19.33 39.65,19.33 39.27,19.72 39.27,23.69 40.36,24.79 40.36,28.78 v1(39.75,29.39)
GL_B: length 22.9
  Top Layer w0.254: v1(30.1,17.45) 29.47,18.08 R69.2 ; v1(36.58,25.33) 36.2,25.71 U2.36
  Inner1 w0.254: v1(36.58,25.33) 36.58,24.69 35.81,23.93 35.81,15.55 34.29,14.03 30.99,14.03 30.48,14.53 30.48,17.2 30.23,17.45 v1(30.1,17.45)
GL_C: length 30.6
  Top Layer w0.254: v1(17.65,16.44) 17.65,17.18 R68.2 ; U2.31 v1(33.7,28.76)
  Inner1 w0.254: v1(17.65,16.44) 17.65,17.19 17.17,17.67 17.17,24.84 18.52,26.19 18.64,26.19 18.67,26.22 21.34,26.22 24.38,29.27 33.19,29.27 v1(33.7,28.76)
LED0_PA5: length 11.5
  Top Layer w0.254: v1(27.31,48.95) 27.43,48.82 27.43,47.17 28.09,46.51 U1.21 ; v1(25.91,53.65) 24.97,53.65 R26.1
  Bottom Layer w0.254: v1(27.31,48.95) 27.31,50.35 25.91,51.75 v1(25.91,53.65)
LED1_PA6: length 13.1
  Top Layer w0.254: v1(23.75,53.52) 23.58,53.7 R27.1 ; v1(26.8,47.94) 27.05,47.68 27.05,46.79 27.83,46.01 U1.22
  Bottom Layer w0.254: v1(23.75,53.52) 23.75,50.98 v1(26.8,47.94)
LED2_PA7: length 15.1
  Top Layer w0.254: R36.1 21.33,53.66 v1(21.46,53.52) ; v1(26.54,45.65) 26.68,45.51 U1.23
  Bottom Layer w0.254: v1(26.54,45.65) 22.35,49.84 22.35,52 21.46,52.89 v1(21.46,53.52)
M_AH: length 10.1
  Top Layer w0.254: v1(37.59,40.57) 37.59,39.03 U1.43 ; U2.13 v1(36.2,33.84)
  Inner1 w0.254: v1(37.59,40.57) 37.54,40.52 37.54,37.15 36.8,36.42 36.8,34.45 36.2,33.84 v1(36.2,33.84)
M_AL: length 4.6
  Top Layer w0.254: U1.36 34.07,37.74 35.69,36.12 35.69,35.11 U2.14
M_BH: length 8
  Top Layer w0.254: U1.42 37.07,37.51 v1(36.96,37.39) ; U2.15 v1(35.2,33.58)
  Inner1 w0.254: v1(36.96,37.39) 36.45,36.89 36.45,34.73 36.19,34.47 35.66,34.47 35.2,34.02 v1(35.2,33.58)
M_BL: length 4.4
  Top Layer w0.254: U2.16 34.7,36.6 33.57,37.73 U1.35
M_CH: length 11.2
  Top Layer w0.254: U2.17 34.2,33.93 v1(34.29,33.84) ; U1.41 v1(36.57,40.57)
  Inner1 w0.254: v1(36.57,40.57) 36.57,38.03 36.45,38.03 36.09,37.67 36.09,35.11 35.81,34.83 35.03,34.83 34.16,33.97 v1(34.29,33.84)
M_CL: length 4.2
  Top Layer w0.254: U2.18 33.66,35.14 33.66,36.38 33.07,36.96 U1.34
SH_A: length 29.6
  Top Layer w0.254: 40.26,15.42 C12.2 40.32,16.69 ; 40.26,15.42 40.26,14.53 40.51,14.28 41.91,14.28 42.29,13.9 42.29,10.34 43.24,9.39 Q7.9 ; 40.26,15.42 40.39,15.3 v1(41.28,15.3) ; U2.42 39.2,26.39 40.13,25.46 v1(41.02,25.46)
  Inner1 w0.254: v1(41.28,15.3) 42.16,15.3 42.7,15.83 42.7,18.12 41.13,19.69 39.88,19.69 39.62,19.94 39.62,23.55 41.02,24.94 v1(41.02,25.46)
  vias: v1(37.47,5.9) v1(37.47,5) v1(37.47,3.99) v1(37.47,3.09) v1(37.47,2.22) v1(37.47,1.33) v1(38.35,5.9) v1(38.35,5) v1(38.35,3.99) v1(38.35,3.09) v1(38.35,2.22) v1(38.36,1.33) v1(39.35,5.9) v1(39.35,3.99) v1(39.37,5.01) v1(39.37,3.1) v1(39.37,2.22) v1(39.37,1.33) v1(40.39,5.9) v1(40.4,5) v1(40.39,3.99) v1(40.4,3.09) v1(40.4,2.22) v1(40.39,1.32) v1(41.36,5.9) v1(41.4,5.01) v1(41.36,3.99) v1(41.4,3.1) v1(41.36,2.22) v1(41.36,1.32) v1(42.67,5.91) v1(42.72,5.02) v1(42.67,4) v1(42.72,3.11) v1(42.67,2.23) v1(42.67,1.33) v1(43.69,6.03) v1(43.7,5) v1(43.81,3.99) v1(43.82,3.09) v1(43.82,2.22) v1(43.81,1.33) v1(44.58,6.03) v1(44.58,5) v1(44.7,3.99) v1(44.7,3.09) v1(44.7,2.22) v1(44.71,1.33) v1(45.57,6.03) v1(45.59,5.01) v1(45.7,3.99) v1(45.72,3.1) v1(45.72,2.22) v1(45.72,1.33) v1(46.61,6.03) v1(46.62,5) v1(46.74,3.99) v1(46.75,3.09) v1(46.75,2.22) v1(46.74,1.32) v1(47.58,6.03) v1(47.62,5.01) v1(47.71,3.99) v1(47.71,2.22) v1(47.71,1.32) v1(47.75,3.1)
SH_B: length 39
  Top Layer w0.254: U2.37 36.7,28.5 v1(37.21,29.01) ; 27.31,16.19 v1(27.94,15.55) ; 27.31,16.19 C13.2 ; 27.31,16.19 27.31,14.79 27.56,14.53 29.08,14.53 29.46,14.15 29.46,9.71 29.59,9.58 32.29,9.58 Q8.9
  Inner1 w0.254: v1(37.21,29.01) 37.21,28.89 36.25,27.92 36.25,26.55 37.21,25.58 37.21,24.82 36.17,23.78 36.17,15.4 34.44,13.67 30.84,13.67 28.96,15.55 v1(27.94,15.55)
  vias: v1(24.64,5.77) v1(24.65,4.87) v1(24.64,3.87) v1(24.65,2.97) v1(24.65,2.09) v1(24.64,1.2) v1(25.53,5.77) v1(25.53,4.87) v1(25.53,3.87) v1(25.53,2.97) v1(25.53,2.09) v1(25.53,1.2) v1(26.52,5.77) v1(26.54,4.88) v1(26.52,3.87) v1(26.54,2.98) v1(26.54,2.09) v1(26.54,1.2) v1(27.56,5.77) v1(27.57,4.87) v1(27.56,3.87) v1(27.57,2.96) v1(27.57,2.09) v1(27.56,1.19) v1(28.53,5.77) v1(28.53,3.87) v1(28.53,2.09) v1(28.53,1.19) v1(28.57,4.88) v1(28.57,2.98) v1(29.46,5.8) v1(29.51,4.91) v1(29.46,3.89) v1(29.51,3) v1(29.46,2.11) v1(29.46,1.22) v1(30.35,5.9) v1(30.36,5) v1(30.35,3.99) v1(30.36,3.09) v1(30.36,2.22) v1(30.35,1.33) v1(31.24,5.9) v1(31.24,5) v1(31.24,3.99) v1(31.24,3.09) v1(31.24,2.22) v1(31.24,1.33) v1(32.23,5.9) v1(32.23,3.99) v1(32.26,5.01) v1(32.26,3.1) v1(32.26,2.22) v1(32.26,1.33) v1(33.27,5.9) v1(33.29,5) v1(33.27,3.99) v1(33.29,3.09) v1(33.29,2.22) v1(33.28,1.32) v1(34.25,5.9) v1(34.25,3.99) v1(34.25,2.22) v1(34.25,1.32) v1(34.29,5.01) v1(34.29,3.1)
SH_C: length 46.8
  Top Layer w0.254: C14.2 14.73,16.63 ; 14.73,16.63 14.73,15.17 16,15.17 16.89,14.28 16.89,10.22 17.62,9.48 Q9.9 ; 14.73,16.63 15.05,16.31 v1(15.49,16.31) ; U2.32 34.2,25.93 34.42,25.71 v1(34.54,25.71)
  Inner1 w0.254: v1(34.54,25.71) 34.16,26.09 34.16,27.87 34.42,28.12 34.42,29.01 33.78,29.65 24.26,29.65 21.18,26.57 18.39,26.57 16.81,25 16.81,19.92 15.49,18.6 v1(15.49,16.31)
  vias: v1(10.79,5.9) v1(10.8,5) v1(10.79,3.99) v1(10.8,3.09) v1(10.8,2.22) v1(10.79,1.33) v1(11.68,5.9) v1(11.68,5) v1(11.68,3.99) v1(11.68,3.09) v1(11.68,2.22) v1(11.69,1.33) v1(12.68,5.9) v1(12.7,5.01) v1(12.68,3.99) v1(12.7,3.1) v1(12.7,2.22) v1(12.7,1.33) v1(13.72,5.9) v1(13.73,5) v1(13.72,3.99) v1(13.73,3.09) v1(13.73,2.22) v1(13.72,1.32) v1(14.69,5.9) v1(14.73,5.01) v1(14.69,3.99) v1(14.73,3.1) v1(14.69,2.22) v1(14.69,1.32) v1(15.49,5.9) v1(15.51,5) v1(15.49,3.99) v1(15.51,3.09) v1(15.51,2.22) v1(15.5,1.32) v1(16.47,5.9) v1(16.51,5.01) v1(16.47,3.99) v1(16.51,3.1) v1(16.47,2.22) v1(16.47,1.32) v1(17.4,5.77) v1(17.41,4.87) v1(17.4,3.99) v1(17.41,3.09) v1(17.41,2.22) v1(17.4,1.33) v1(18.29,5.77) v1(18.29,4.87) v1(18.29,3.99) v1(18.29,3.09) v1(18.29,2.22) v1(18.29,1.33) v1(19.28,5.77) v1(19.3,4.88) v1(19.28,3.99) v1(19.3,3.1) v1(19.3,2.22) v1(19.3,1.33) v1(20.32,5.77) v1(20.33,4.87) v1(20.32,3.99) v1(20.33,3.09) v1(20.33,2.22) v1(20.32,1.32) v1(21.29,5.77) v1(21.34,4.88) v1(21.29,3.99) v1(21.34,3.1) v1(21.29,2.22) v1(21.29,1.32)
SL_B: length 27.6
  Top Layer w0.254: 36.19,29.14 36.08,29.14 35.7,28.76 U2.35 ; U2.29 32.7,25.9 v1(33.27,25.33)
  Inner1 w0.254: v1(33.02,17.84) 33.02,17.96 35.43,20.38 35.43,24.19 35.89,24.64 35.89,28.07 36.32,28.5 v1(36.32,29.01) ; v1(33.27,25.33) 33.5,25.1 34.39,25.1 35.05,24.44 35.05,20.5 33.78,19.23 32.51,19.23 32.14,18.86 v1(32.14,17.84)
  vias: v1(31.24,17.84) v1(31.24,16.86) v1(31.24,15.83) v1(31.24,14.83) v1(32.14,16.88) v1(32.13,15.85) v1(32.14,14.83) v1(33.02,16.88) v1(33.02,15.85) v1(33.02,14.83) v1(33.92,17.84) v1(33.92,16.87) v1(33.91,15.85) v1(33.91,14.84)
SL_C: length 49.3
  Top Layer w0.254: U2.27 v1(31.7,25.46) ; U2.30 33.2,26.42 v1(33.53,26.09)
  Inner1 w0.254: v1(31.7,25.46) 31.37,25.13 23.55,25.13 22.61,24.19 22.61,20 21.86,19.26 19.96,19.26 19.43,18.72 19.43,18.06 v1(19.57,17.92) ; v1(33.53,26.09) 33.15,26.47 33.15,28.38 32.61,28.91 24.54,28.91 21.46,25.84 18.67,25.84 17.53,24.69 17.53,19.87 18.67,18.72 18.67,18.17 18.8,18.05 v1(18.67,17.92)
  vias: v1(18.67,16.95) v1(18.67,15.91) v1(18.67,14.92) v1(19.57,16.96) v1(19.56,15.93) v1(19.57,14.92) v1(20.45,17.92) v1(20.45,16.96) v1(20.45,15.93) v1(20.45,14.92) v1(21.34,17.92) v1(21.34,16.95) v1(21.34,15.93) v1(21.34,14.92)
SO1: length 12.5
  Top Layer w0.254: v1(27.05,41.46) 27.05,42.73 28.32,44 30.56,44 U1.26 ; C15.2 23.56,38.79 26.16,38.79 26.29,38.92 R4.1 26.92,39.54 v1(27.05,39.68)
  Inner1 w0.254: v1(27.05,39.68) v1(27.05,41.46)
SO2: length 16.9
  Top Layer w0.254: U1.27 30.55,43.49 28.32,43.49 27.66,42.83 27.66,41.05 27.31,40.7 25.54,40.7 ; C16.2 20.32,38.85 20.32,40.19 20.83,40.7 25.54,40.7 ; R5.1 25.54,40.7
SPI1_MISO_ENC: length 16.9
  Top Layer w0.254: U1.56 43.2,44.51 43.58,44.89 44.18,44.89 44.94,44.12 v1(46.61,44.12) ; R72.2 49.4,35.15 49.4,36.25 46.86,38.79 46.86,41.58
  Bottom Layer w0.254: v1(46.61,44.12) 47.12,43.62 47.12,41.79 v1(47.03,41.71)
SPI1_MOSI_ENC: length 17
  Top Layer w0.254: v1(47.62,40.7) 47.24,40.31 47.24,39.28 R71.2 ; U1.57 43.18,45.01 43.56,45.39 43.56,45.78 43.94,46.15 45.47,46.15 v1(45.85,45.78)
  Bottom Layer w0.254: v1(45.85,45.78) 46.23,45.78 47.62,44.38 v1(47.62,40.7)
SPI1_NSS_ENC: length 23.5
  Top Layer w0.254: U1.54 40.03,43.51 39.12,42.6 39.12,41.97 40.64,40.44 45.37,40.44 45.85,39.96 45.85,38.16 48.64,35.36 48.64,31.88 R74.2
SPI1_SCK_ENC: length 17.1
  Top Layer w0.254: U1.55 43.17,44.01 43.56,43.62 44.2,43.62 45.34,42.47 46.23,42.47 46.35,42.35 46.35,38.54 49.02,35.87 49.02,33.56 R73.2
SPI3_MISO_DRV: length 13.7
  Top Layer w0.254: v1(40.39,33.33) 40.2,33.52 U2.5 ; U1.52 v1(39.88,42.51)
  Inner1 w0.254: v1(40.39,33.33) 39.55,34.17 39.55,42.14 39.88,42.47 v1(39.88,42.51)
SPI3_MOSI_DRV: length 17.7
  Top Layer w0.254: U2.6 39.7,34.17 39.5,33.97 v1(39.5,33.33) ; U1.53 v1(43.69,43.01)
  Inner1 w0.254: v1(39.5,33.33) 39.19,33.64 39.19,42.68 39.62,43.11 43.59,43.11 v1(43.69,43.01)
SPI3_NSS_DRV: length 12
  Top Layer w0.254: U2.4 40.7,33.91 40.89,33.71 41.28,33.71 v1(41.53,33.46) ; U1.50 v1(40.77,41.51)
  Inner1 w0.254: v1(40.77,41.51) 41.66,40.62 41.66,33.58 v1(41.53,33.46)
SPI3_SCK_DRV: length 14
  Top Layer w0.254: v1(43.69,41.97) 42.12,41.97 U1.51 ; U2.7 39.2,35.92 39.66,36.38 v1(40.51,36.38)
  Inner1 w0.254: v1(40.51,36.38) 41.3,37.17 41.3,40.15 40.18,41.27 40.18,41.76 40.68,42.26 43.39,42.26 v1(43.69,41.97)
SWCLK: length 36.2
  Top Layer w0.254: v1(46.23,36.38) 46.23,36.33 48.26,34.3 48.26,27.36 49.91,25.71 49.91,15.41 51.07,14.25 U12.5 ; U1.49 44.26,41.01 v1(44.32,41.08)
  Inner1 w0.254: v1(46.23,36.38) 46.1,36.5 46.1,40.7 45.85,40.95 44.45,40.95 v1(44.32,41.08)
SWDIO: length 36.4
  Top Layer w0.254: U1.46 39.07,37.56 39.5,37.14 v1(40.13,37.14) 42.54,37.14 42.93,36.76 42.93,34.09 42.29,33.46 42.29,32.82 49.56,25.56 49.56,15.27 51.81,13.01 54.58,13.01 U12.4
USART6_RX: length 49.3
  Top Layer w0.254: v1(44.2,29.9) 44.32,29.9 44.7,29.52 45.09,29.52 49.2,25.41 49.2,15.12 52.57,11.75 U12.3 ; v1(36.19,41.71) 36.19,41.2 35.07,40.08 U1.38
  Bottom Layer w0.254: v1(44.2,29.9) 42.29,29.9 40.28,31.91 34.19,31.91 33.27,32.82 33.27,35.11 35.66,37.5 35.66,41.18 v1(36.19,41.71)
USATR6_TX: length 50.4
  Top Layer w0.254: U12.2 53.31,10.5 48.84,14.97 48.84,25.26 45.34,28.76 v1(44.58,28.76) ; U1.37 34.57,40.34 35.31,41.08 v1(35.31,41.97)
  Bottom Layer w0.254: v1(44.58,28.76) 44.2,29.14 42.54,29.14 40.13,31.55 34.04,31.55 32.89,32.7 32.89,35.23 35.31,37.65 v1(35.31,41.97)
USB_DM_PA11: length 29.9
  Top Layer w0.254: USBC1.A7 51.57,45.01 v1(51.44,45.14) 51.18,45.39 47.75,45.39 47.12,44.76 45.21,44.76 v1(44.45,45.52) ; USBC1.B7 54.34,44.01 v1(54.48,43.87) ; U1.44 38.07,37.55 38.35,37.27
  Inner1 w0.254: v1(54.48,43.87) 53.47,44.89 51.69,44.89 v1(51.44,45.14)
  Bottom Layer w0.254: v1(38.48,37.39) 38.1,37.78 38.1,38.92 38.48,39.3 38.48,44.12 39.12,44.76 42.67,44.76 43.43,45.52 v1(44.45,45.52)
USB_DP_PA12: length 24.6
  Top Layer w0.254: v1(39.37,44) 38.57,43.2 U1.45 ; v1(49.53,43.49) 44.96,43.49 44.2,44.25 v1(43.94,44.25) ; USBC1.B6 54.75,45.51 54.99,45.27 54.99,44.51 53.03,44.51 USBC1.A6 51.82,44.51 v1(51.44,44.12)
  Inner1 w0.254: v1(49.53,43.49) 50.8,43.49 v1(51.44,44.12)
  Bottom Layer w0.254: v1(43.94,44.25) 39.62,44.25 v1(39.37,44)
$1N588: length 6.2
  Top Layer w0.254: U1.5 38.07,52.48 38.99,53.4 40.13,53.4 40.51,53.78 40.51,54.82 X2.3
$1N664: length 8.3
  Top Layer w0.254: R1.1 48.13,48.44 47.88,48.19 47.88,47.05 47.34,46.51 U1.60
$1N1058: length 4.2
  Top Layer w0.254: 30.88,41.44 30.86,41.46 28.83,41.46 28.32,40.95 C1.2
$1N1138: length 5.7
  Top Layer w0.254: U1.47 39.57,37.73 41.23,37.73 41.78,38.28 41.78,38.66 42.48,39.36 C2.2
$1N1421: length 18.2
  Top Layer w0.254: 36.46,54.67 R2.2 36.07,55.56 36.07,57.08 35.69,57.46 31.75,57.46 31.5,57.21 31.5,55.66 SW9.1 ; 36.46,54.67 36.51,54.73 C3.2 36.9,54.67 36.46,54.67 ; 36.46,54.67 37.07,54.06 U1.7
$1N1824: length 10.1
  Top Layer w0.254: R3.2 46.85,32.69 46.23,32.69 46.23,34.98 45.72,35.49 v1(44.07,35.49) ; v1(42.29,36.5) 41.4,36.5 41.2,36.3 U2.3
  Inner1 w0.254: v1(42.29,36.5) 43.05,36.5 v1(44.07,35.49)
$1N1939: length 11.5
  Top Layer w0.254: v1(37.85,33.58) 38.2,33.94 U2.9 ; v1(45.34,31.93) 45.47,32.06 C10.1
  Inner1 w0.254: v1(45.34,31.93) 45.09,31.93 44.58,32.44 43.69,32.44 43.43,32.19 38.48,32.19 37.85,32.82 v1(37.85,33.58)
$1N2052: length 12.2
  Top Layer w0.254: v1(43.18,33.2) 43.27,33.2 44.2,34.13 C4.2 ; U2.10 37.7,36.23 38.1,36.63
  Inner1 w0.254: v1(43.18,33.2) 42.52,32.54 38.76,32.54 38.48,32.82 38.48,36 v1(37.97,36.5)
$1N2055: length 10.9
  Top Layer w0.254: v1(44.2,31.81) C4.1 ; U2.11 37.2,33.83 v1(36.96,33.58)
  Inner1 w0.254: v1(36.96,33.58) 36.96,33.2 38.35,31.81 v1(44.2,31.81)
$1N2659: length 6.2
  Top Layer w0.254: U2.23 31.2,34.18 30.86,33.84 26.86,33.84 C9.1
$1N2783: length 11
  Top Layer w0.254: U2.19 33.2,34.02 32.64,33.46 24.51,33.46 24.38,33.58 C11.1
$1N2865: length 8.4
  Top Layer w0.254: U2.21 32.2,36.56 31.62,37.14 26.54,37.14 26.42,37.27 26.42,37.91 R4.2
$1N2894: length 9.9
  Top Layer w0.254: U2.22 31.7,36.56 31.5,36.76 24.76,36.76 24.38,37.14 R5.2
$1N3761: length 25.3
  Top Layer w0.254: v1(39.12,14.79) 39.12,17.45 39.62,17.96 40.19,17.96 C12.1 39.94,18.34 ; U2.44 40.2,26.68 40.66,26.22 41.28,26.22 42.04,25.46 v1(42.04,25.33)
  Inner1 w0.254: 40.21,20.05 40.03,20.05 ; 40.21,20.05 41.28,20.05 43.05,18.27 43.05,14.66 39.24,14.66 ; 40.21,20.05 39.98,20.27 39.98,23.4 41.91,25.33 v1(42.04,25.33)
$1N3769: length 34.2
  Top Layer w0.254: U2.39 37.7,28.65 38.06,29.01 v1(38.1,29.01) ; v1(27.31,17.96) C13.1
  Inner1 w0.254: v1(38.1,29.01) 37.59,28.5 37.59,26.54 38.43,25.7 38.43,25.02 36.88,23.47 36.88,15.1 34.69,12.91 30.6,12.91 29.07,14.43 26.78,14.43 26.19,15.02 26.19,16.41 25.65,16.95 25.65,17.96 v1(27.31,17.96)
$1N3777: length 42.1
  Top Layer w0.254: 14.54,18.22 C14.1 14.29,18.16 13.84,17.71 v1(13.84,15.68) ; v1(35.31,25.33) 35.2,25.44 U2.34
  Inner1 w0.254: v1(13.84,15.68) 13.84,18.08 16.1,20.34 16.1,25.3 18.09,27.29 20.89,27.29 23.96,30.36 34.44,30.36 35.69,29.06 35.69,28.5 35.13,27.95 35.13,25.51 v1(35.31,25.33)
$1N4933: length 11.1
  Top Layer w0.254: U3.1 12.39,28.69 v1(12.32,28.76) ; v1(12.7,37.78) C17.2
  Inner1 w0.254: v1(12.7,37.78) 12.32,37.39 v1(12.32,28.76)
$1N5046: length 3.1
  Top Layer w0.254: 16.07,26.6 16.07,27.17 15.75,27.49 14.99,27.49 14.76,27.71 U3.4
$1N5104: length 3.1
  Top Layer w0.254: R64.2 18.03,28 15.95,28 U3.5
$1N5267: length 2
  Top Layer w0.254: C21.1 R55.2
$1N5275: length 4.2
  Top Layer w0.254: 14.26,35.39 C20.1 ; 14.26,35.39 14.28,35.37 R55.1 ; 14.26,35.39 U3.8
$1N5335: length 6.8
  Top Layer w0.254: R56.2 18.03,33.76 ; 18.03,33.76 R57.1 ; 18.03,33.76 17.7,34.09 15.11,34.09 14.76,33.74 U3.7
$1N14306: length 4.4
  Top Layer w0.254: R68.1 16.65,16.13 17.24,15.55 17.75,15.55 17.75,13.02
$1N14335: length 4.2
  Top Layer w0.254: Q8.4 30.58,13.68 29.21,15.04 R69.1
$1N14364: length 3.9
  Top Layer w0.254: R70.1 42.04,14.92 43.05,13.9 43.05,13.17 Q7.4
$1N18515: length 2.6
  Top Layer w0.254: USBC1.B5 53,46.54 R17.1
$1N18516: length 3.6
  Top Layer w0.254: USBC1.A5 53,43.49 50.55,43.49 50.41,43.63 R16.2
$1N19444: length 2.9
  Top Layer w0.254: 54.46,34.7 53.8,35.36 52.64,35.36 52.11,35.89 R71.1
$1N19497: length 2.6
  Top Layer w0.254: 54.46,33.45 53.96,33.95 R72.1
$1N19526: length 2.4
  Top Layer w0.254: 54.46,32.2 54.23,31.97 R73.1
$1N19555: length 3.2
  Top Layer w0.254: R74.1 52.11,30.7 52.35,30.95 54.46,30.95
$1N20180: length 1.9
  Top Layer w0.254: LED4.1 24.97,55.18
$1N20181: length 1.9
  Top Layer w0.254: LED5.1 22.66,55.21
$1N20185: length 1.7
  Top Layer w0.254: R28.1 19.18,40.43 LED6.2
$1N20188: length 1.7
  Top Layer w0.254: R29.1 19.18,45.26 LED7.2
$1N20191: length 2.2
  Top Layer w0.254: LED9.2 17.55,48.71 R31.1
$1N20194: length 1.9
  Top Layer w0.254: LED10.1 20.52,55.18
$1N21133: length 2.4
  Top Layer w0.254: 6.73,16.06 6.99,16.06 LED11.2
$1N23634: length 13.3
  Top Layer w0.254: R65.1 38.35,14.28 38.74,13.9 41.66,13.9 41.91,13.64 41.91,7.29 41.66,7.04 41.25,7.04 41.09,7.2
$1N23641: length 13.4
  Top Layer w0.254: R66.1 25.27,14.28 25.4,14.15 28.83,14.15 29.08,13.9 29.08,7.55 28.83,7.29 28.4,7.29 Q5.4
$1N23648: length 13.5
  Top Layer w0.254: Q6.4 16.13,7.41 16.38,7.67 16.38,14.03 16.13,14.28 13.05,14.28 12.47,14.86 R67.1

## Copper pours and planes (outline as drawn; the poured copper is in the pictures)
5V on Top Layer: 9.27,48.95 12.19,48.95 12.19,48.06 9.27,48.06
5V on Top Layer: 11.18,48.11 12.19,48.11 12.19,45.33 11.18,45.33
5V on Top Layer: 9.2,43.49 11.36,43.49 11.36,36.57 9.2,36.57
5V on Top Layer: 7.62,44.12 12.45,44.12 12.45,43.36 7.62,43.36
GND on Top Layer: -1.65,61.65 72.39,61.65 72.39,26.73 -1.65,26.73
GND on Top Layer: 48.64,26.47 60.2,26.47 60.2,-0.07 48.64,-0.07
GND on Bottom Layer: 48.64,26.05 60.37,26.05 60.37,0.06 48.64,0.06
GND on Bottom Layer: -1.65,61.78 72.39,61.78 72.39,26.73 -1.65,26.73
GND on Inner1: 48.62,25.71 60.07,25.71 60.07,0.06 48.62,0.06
GND on Inner1: -1.65,61.78 72.39,61.78 72.39,26.73 -1.65,26.73
GND on Inner2: 48.62,25.49 60.07,25.49 60.07,0.06 48.62,0.06
GND on Inner2: -1.65,61.78 72.39,61.78 72.39,26.73 -1.65,26.73
PGND on Top Layer: 43.43,21.05 47.4,21.05 47.4,12.43 43.43,12.43
PGND on Top Layer: 3.4,43.5 4.83,43.5 4.83,21.47 3.4,21.47
PGND on Top Layer: 1.02,24.79 47.26,24.79 47.26,17.35 1.02,17.35
PGND on Bottom Layer: 1.02,16.31 13.02,16.31 13.02,14.86 1.02,14.86
PGND on Bottom Layer: 1.02,18.6 11.43,18.6 11.43,15.93 1.02,15.93
PGND on Bottom Layer: 22.21,19.61 26.74,19.61 26.74,14.94 22.21,14.94
PGND on Bottom Layer: 1.02,22.41 47.5,22.41 47.5,18.6 1.02,18.6
PGND on Inner1: 1.02,22.41 13.21,22.41 13.21,17.28 1.02,17.28
PGND on Inner1: 43.43,24.84 47.3,24.84 47.3,13.72 43.43,13.72
PGND on Inner2: 14.67,24.84 47.5,24.84 47.5,18.6 14.67,18.6
PGND on Inner2: 11.68,22.03 14.86,22.03 14.86,18.6 11.68,18.6
DCBUS on Top Layer: 5.97,26.47 13.97,26.47 13.97,22.68 5.97,22.68
DCBUS on Top Layer: 1.52,43.49 3.14,43.49 3.14,22.66 1.52,22.66
DCBUS on Top Layer: 1.14,13.77 16,13.77 16,6.67 1.14,6.67
DCBUS on Top Layer: 12.06,27.61 13.97,27.61 13.97,26.47 12.06,26.47
DCBUS on Top Layer: 12.06,26.47 13.97,26.47 13.97,23.3 12.06,23.3
DCBUS on Bottom Layer: 1.14,14.53 13.01,14.53 13.01,13.14 1.14,13.14
DCBUS on Bottom Layer: 22.21,14.43 27.18,14.43 27.18,13.16 22.21,13.16
DCBUS on Bottom Layer: 1.11,13.74 47.91,13.74 47.91,6.63 1.11,6.63
DCBUS on Inner1: 1.14,13.77 47.9,13.77 47.9,6.66 1.14,6.66
DCBUS on Inner2: 12.06,27.61 13.97,27.61 13.97,26.47 12.06,26.47
DCBUS on Inner2: 1.52,23.42 5.97,23.42 5.97,22.53 1.52,22.53
DCBUS on Inner2: 1.14,13.77 47.9,13.77 47.9,6.67 1.14,6.67
DCBUS on Inner2: 5.93,26.47 13.97,26.47 13.97,8.56 5.93,8.56
DCBUS on Inner2: 1.52,43.49 3.17,43.49 3.17,23.17 1.52,23.17
SH_A on Top Layer: 36.96,11.42 48.39,11.42 48.39,0.82 36.96,0.82
SH_A on Inner1: 36.98,7.7 48.39,7.7 48.39,0.82 36.98,0.82
SH_A on Inner2: 36.96,7.8 48.39,7.8 48.39,0.82 36.96,0.82
SH_B on Top Layer: 24.26,11.39 34.7,11.39 34.7,0.82 24.26,0.82
SH_B on Inner1: 24.26,7.79 34.67,7.79 34.67,0.82 24.26,0.82
SH_B on Inner2: 24.26,7.8 34.67,7.8 34.67,0.94 24.26,0.94
SH_C on Top Layer: 10.44,11.48 21.86,11.48 21.86,0.89 10.44,0.89
SH_C on Inner1: 10.43,7.88 21.85,7.88 21.85,0.94 10.43,0.94
SH_C on Inner2: 10.54,8.06 21.84,8.06 21.84,0.94 10.54,0.94
SL_B on Top Layer: 30.75,18.22 34.67,18.22 34.67,12.38 30.75,12.38
SL_C on Top Layer: 18.19,18.31 21.86,18.31 21.86,12.46 18.19,12.46
$1N4921 on Top Layer: 9.14,35.74 13.46,35.74 13.46,31.29 9.14,31.29

Small or netless copper shapes (teardrops, artwork), in the pictures only: 43 on Top Layer, 6 on Bottom Layer, 1 on Inner1

## Text on the board
Top Silkscreen Layer: 5 | K | O | X | T | G | I | 0 | H | L | Drv8303 f405 | + | C | B | A | -
